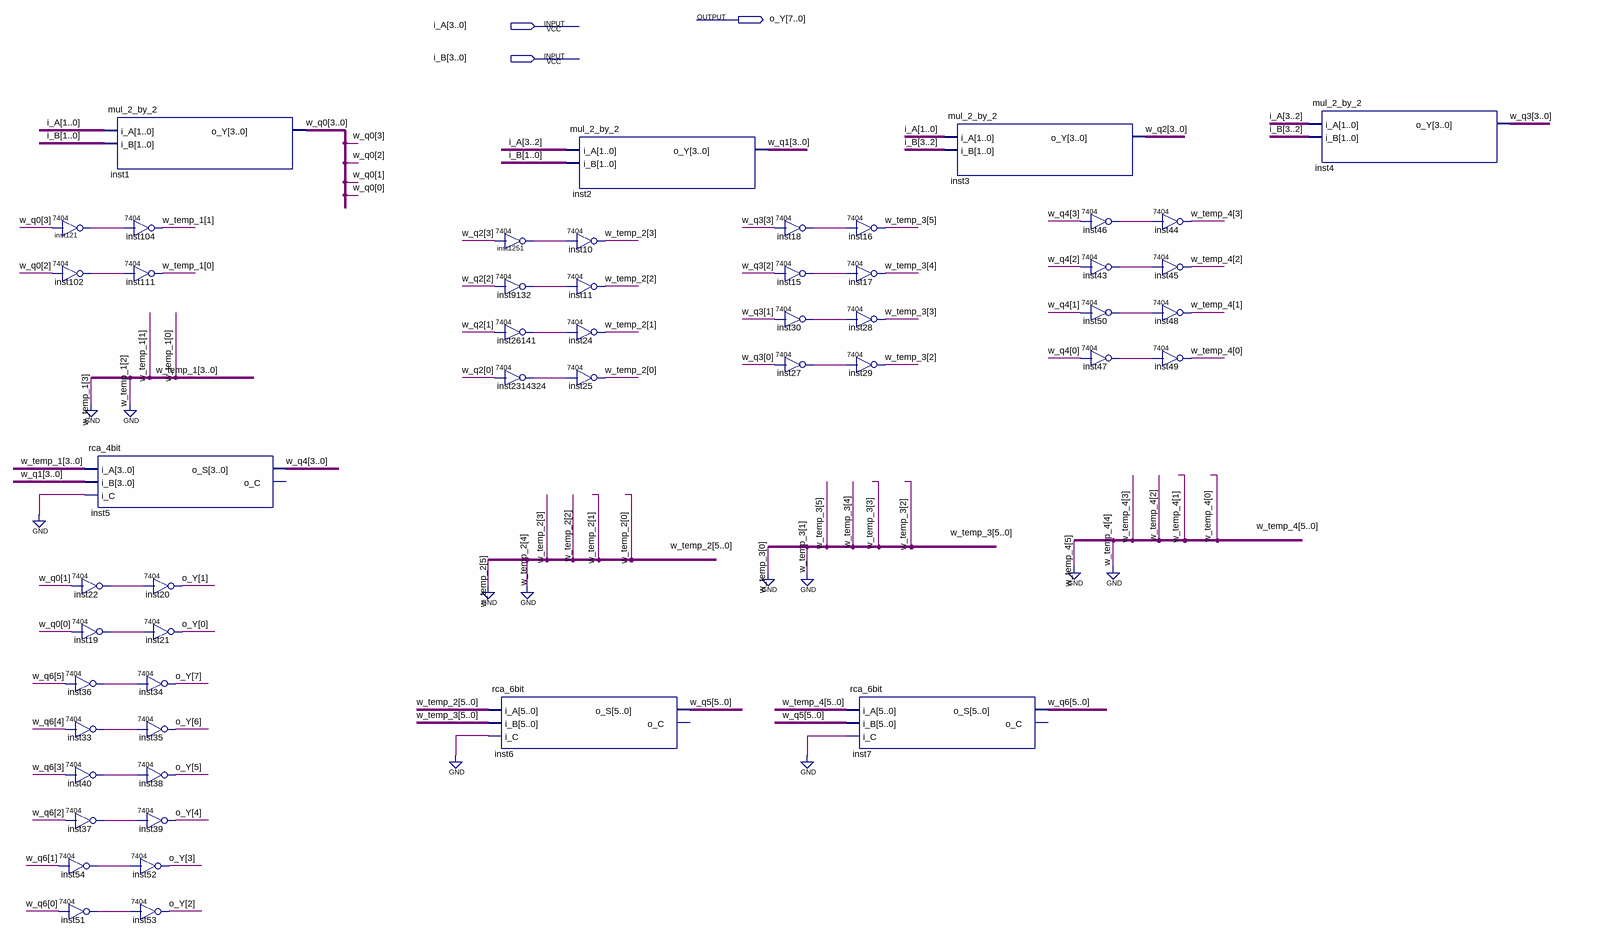
[diagram p0: schematic sheet]
// Quartus schematic mul_4_by_4.bdf as structural Verilog: 51 symbols, 3 pins
module mul_4_by_4 (
  input  [3:0] i_A,
  input  [3:0] i_B,
  output [7:0] o_Y
);

  wire inst15_1, inst18_1, inst19_1, inst22_1, inst27_1, inst30_1, inst33_1, inst36_1, inst37_1, inst40_1,
       inst43_1, inst46_1, inst47_1, inst50_1, inst51_1, inst54_1, inst102_1, inst121_1, inst1251_1,
       inst9132_1, inst26141_1, inst2314324_1;
  wire [1:0] w_temp_1;
  wire [3:0] w_q0, w_q1, w_q2, w_q3, w_q4, w_temp_2, w_temp_4;
  wire [5:0] w_q5, w_q6;
  wire [5:2] w_temp_3;

  \7404  inst121 (.\2 (w_q0[3]), .\1 (inst121_1));
  \7404  inst102 (.\2 (w_q0[2]), .\1 (inst102_1));
  \7404  inst54 (.\2 (w_q6[1]), .\1 (inst54_1));
  \7404  inst51 (.\2 (w_q6[0]), .\1 (inst51_1));
  mul_2_by_2 inst1 (.i_A(i_A[1:0]), .i_B(i_B[1:0]), .o_Y(w_q0));
  rca_4bit inst5 (.i_A({2'b00, w_temp_1}), .i_B(w_q1), .i_C(1'b0), .o_S(w_q4));  // open: o_C
  \7404  inst22 (.\2 (w_q0[1]), .\1 (inst22_1));
  \7404  inst19 (.\2 (w_q0[0]), .\1 (inst19_1));
  \7404  inst36 (.\2 (w_q6[5]), .\1 (inst36_1));
  \7404  inst33 (.\2 (w_q6[4]), .\1 (inst33_1));
  \7404  inst40 (.\2 (w_q6[3]), .\1 (inst40_1));
  \7404  inst37 (.\2 (w_q6[2]), .\1 (inst37_1));
  \7404  inst104 (.\2 (inst121_1), .\1 (w_temp_1[1]));
  \7404  inst111 (.\2 (inst102_1), .\1 (w_temp_1[0]));
  \7404  inst20 (.\2 (inst22_1), .\1 (o_Y[1]));
  \7404  inst21 (.\2 (inst19_1), .\1 (o_Y[0]));
  \7404  inst34 (.\2 (inst36_1), .\1 (o_Y[7]));
  \7404  inst35 (.\2 (inst33_1), .\1 (o_Y[6]));
  \7404  inst38 (.\2 (inst40_1), .\1 (o_Y[5]));
  \7404  inst39 (.\2 (inst37_1), .\1 (o_Y[4]));
  \7404  inst52 (.\2 (inst54_1), .\1 (o_Y[3]));
  \7404  inst53 (.\2 (inst51_1), .\1 (o_Y[2]));
  \7404  inst1251 (.\2 (w_q2[3]), .\1 (inst1251_1));
  \7404  inst9132 (.\2 (w_q2[2]), .\1 (inst9132_1));
  \7404  inst26141 (.\2 (w_q2[1]), .\1 (inst26141_1));
  \7404  inst2314324 (.\2 (w_q2[0]), .\1 (inst2314324_1));
  rca_6bit inst6 (.i_A({2'b00, w_temp_2}), .i_B({w_temp_3, 2'b00}), .i_C(1'b0), .o_S(w_q5));  // open: o_C
  mul_2_by_2 inst2 (.i_A(i_A[3:2]), .i_B(i_B[1:0]), .o_Y(w_q1));
  \7404  inst10 (.\2 (inst1251_1), .\1 (w_temp_2[3]));
  \7404  inst11 (.\2 (inst9132_1), .\1 (w_temp_2[2]));
  \7404  inst24 (.\2 (inst26141_1), .\1 (w_temp_2[1]));
  \7404  inst25 (.\2 (inst2314324_1), .\1 (w_temp_2[0]));
  \7404  inst18 (.\2 (w_q3[3]), .\1 (inst18_1));
  \7404  inst15 (.\2 (w_q3[2]), .\1 (inst15_1));
  \7404  inst30 (.\2 (w_q3[1]), .\1 (inst30_1));
  \7404  inst27 (.\2 (w_q3[0]), .\1 (inst27_1));
  \7404  inst16 (.\2 (inst18_1), .\1 (w_temp_3[5]));
  \7404  inst17 (.\2 (inst15_1), .\1 (w_temp_3[4]));
  \7404  inst28 (.\2 (inst30_1), .\1 (w_temp_3[3]));
  \7404  inst29 (.\2 (inst27_1), .\1 (w_temp_3[2]));
  rca_6bit inst7 (.i_A({2'b00, w_temp_4}), .i_B(w_q5), .i_C(1'b0), .o_S(w_q6));  // open: o_C
  mul_2_by_2 inst3 (.i_A(i_A[1:0]), .i_B(i_B[3:2]), .o_Y(w_q2));
  \7404  inst46 (.\2 (w_q4[3]), .\1 (inst46_1));
  \7404  inst43 (.\2 (w_q4[2]), .\1 (inst43_1));
  \7404  inst50 (.\2 (w_q4[1]), .\1 (inst50_1));
  \7404  inst47 (.\2 (w_q4[0]), .\1 (inst47_1));
  \7404  inst44 (.\2 (inst46_1), .\1 (w_temp_4[3]));
  \7404  inst45 (.\2 (inst43_1), .\1 (w_temp_4[2]));
  \7404  inst48 (.\2 (inst50_1), .\1 (w_temp_4[1]));
  \7404  inst49 (.\2 (inst47_1), .\1 (w_temp_4[0]));
  mul_2_by_2 inst4 (.i_A(i_A[3:2]), .i_B(i_B[3:2]), .o_Y(w_q3));
endmodule
